# EAGLE design grove_buf_nomal (EAGLE 9.4.2)
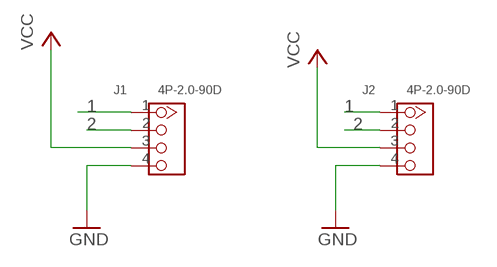
[diagram p0: schematic, sheet 1]

## Parts
J1  4P-2.0-90D  GROVE-CONNECTOR-DIP-90D(4P-2.0)  [HW4-2.0-90D]
J2  4P-2.0-90D  GROVE-CONNECTOR-DIP-90D(4P-2.0)  [HW4-2.0-90D]

## Nets
1: J1.1 J2.1
2: J1.2 J2.2
GND: J1.4 J2.4
VCC: J1.3 J2.3

## Library data of the parts
J1 J2 = Seeed-Connector:GROVE-CONNECTOR-DIP-90D(4P-2.0): 320110034

## Board
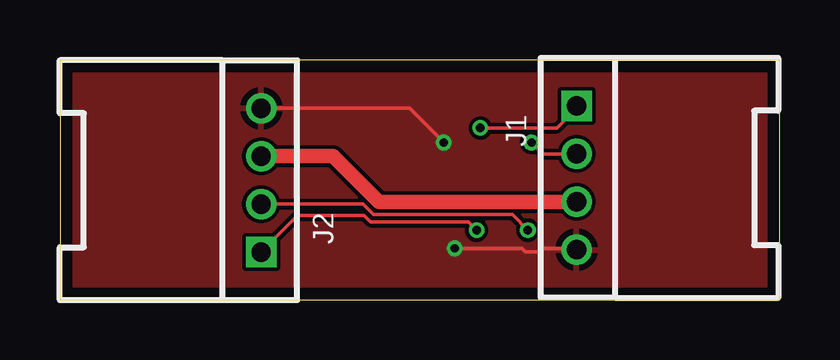
[diagram p1: board, top side]
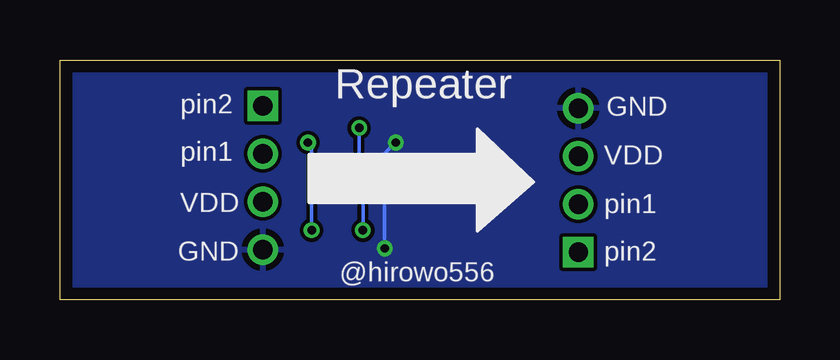
[diagram p2: board, bottom side, seen from below]

Size 30 x 10 mm. Coordinates in mm from the lower left corner, seen from the top.
Outline: 0,0 30,0 30,10 0,10 0,0
Copper layers (1*16): Top 0.035mm / dielectric 1.6mm / Bottom 0.035mm
Design rules "Elecrow_2-layer_PCB_eagle_rule": minimum track width 6mil, minimum drill 12mil, track to track 6mil, track to pad 6mil, pad to pad 6mil, via to via 8mil, smd to smd 0mil, copper to edge 20mil, drill to drill 10mil, minimum pad ring 6mil, minimum via ring 6mil, stop-mask expansion 0mil, vias tented up to drill 100mil, thermal gap 10mil

### Footprints (pad centres in the part's own frame; a part is rotated, then mirrored left to right if it is on the bottom)
HW4-2.0-90D = drill 0.8 pad 1.27 square: 1 -3,0 | drill 0.8 pad 1.27: 2 -1,0; 3 1,0; 4 3,0

### Placement (x,y rotation side)
J1  21.54,5.08 270 top
J2  8.39,4.98 90 top

### Tracks (layer width: path | path; a pad name or v marks a point on that pad's centre or on a via)
1  (via drill 0.35)
  Top 0.152: J2.1 9.91,3.5 12.68,3.5 12.95,3.24 17.03,3.24 v17.37,2.9 | v17.53,7.16 20.73,7.16 21.54,7.98 J1.1
  Bottom 0.152: v17.37,2.9 17.37,4.42 17.53,4.57 v17.53,7.16
2  (via drill 0.35)
  Top 0.152: J2.2 12.64,3.98 13.07,3.55 18.86,3.55 v19.51,2.9 | v19.66,6.55 20.13,6.08 J1.2
  Bottom 0.152: v19.66,6.55 19.51,6.4 v19.51,2.9
GND  (via drill 0.35)
  Top 0.152: J2.4 14.57,7.98 v16,6.55 | J1.4 21.49,2.13 20.06,2.13 19.91,1.98 19.41,1.98 19.26,2.13 v16.46,2.13
  Bottom 0.152: v16,6.55 16.46,6.1 v16.46,2.13
  pour Top: -0.61,-0.46 -0.61,10.36 33.07,10.36 33.07,-0.46
  pour Bottom: -0.76,-0.46 -0.76,10.52 32.92,10.52 32.92,-0.46 32.31,-0.46
VCC
  Top 0.61: J2.3 11.39,5.98 13.29,4.08 J1.3

### Text on the board
bNames: GND | Repeater | pin2 | VDD | pin1 | pin1 | VDD | pin2 | GND | @hirowo556